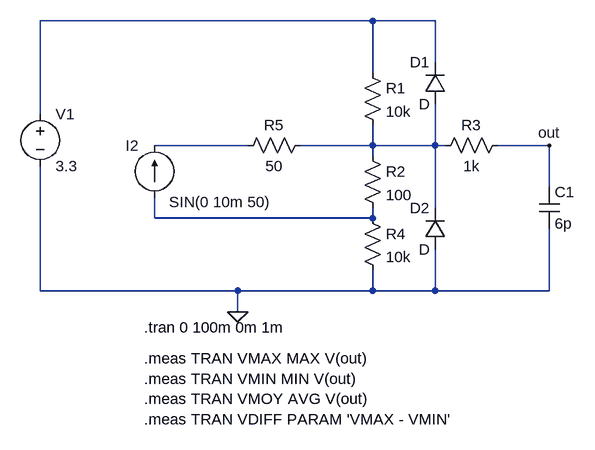
[diagram p0: schematic current_loop.asc]
current_loop.asc, the LTspice schematic file:
Version 4
SHEET 1 880 680
WIRE 256 -368 -256 -368
WIRE 352 -368 256 -368
WIRE 352 -304 352 -368
WIRE 256 -288 256 -368
WIRE -256 -224 -256 -368
WIRE 64 -176 -80 -176
WIRE 256 -176 256 -208
WIRE 256 -176 144 -176
WIRE 352 -176 352 -240
WIRE 352 -176 256 -176
WIRE 368 -176 352 -176
WIRE 528 -176 448 -176
WIRE 256 -160 256 -176
WIRE 528 -112 528 -176
WIRE 352 -80 352 -176
WIRE -80 -64 -80 -96
WIRE 256 -64 256 -80
WIRE 256 -64 -80 -64
WIRE -256 48 -256 -144
WIRE 48 48 -256 48
WIRE 256 48 256 16
WIRE 256 48 48 48
WIRE 352 48 352 -16
WIRE 352 48 256 48
WIRE 528 48 528 -48
WIRE 528 48 352 48
WIRE 48 80 48 48
FLAG 48 80 0
FLAG 528 -176 out
SYMBOL res 240 -304 R0
SYMATTR InstName R1
SYMATTR Value 10k
SYMBOL res 240 -176 R0
SYMATTR InstName R2
SYMATTR Value 100
SYMBOL res 240 -80 R0
SYMATTR InstName R4
SYMATTR Value 10k
SYMBOL voltage -256 -240 R0
WINDOW 123 0 0 Left 0
WINDOW 39 0 0 Left 0
SYMATTR InstName V1
SYMATTR Value 3.3
SYMBOL res 464 -192 R90
WINDOW 0 0 56 VBottom 2
WINDOW 3 32 56 VTop 2
SYMATTR InstName R3
SYMATTR Value 1k
SYMBOL cap 512 -112 R0
SYMATTR InstName C1
SYMATTR Value 6p
SYMBOL diode 368 -240 R180
WINDOW 0 24 64 Left 2
WINDOW 3 24 0 Left 2
SYMATTR InstName D1
SYMBOL diode 368 -16 R180
WINDOW 0 24 64 Left 2
WINDOW 3 24 0 Left 2
SYMATTR InstName D2
SYMBOL res 160 -192 R90
WINDOW 0 0 56 VBottom 2
WINDOW 3 32 56 VTop 2
SYMATTR InstName R5
SYMATTR Value 50
SYMBOL current -80 -96 R180
WINDOW 0 24 80 Left 2
WINDOW 3 -180 -7 Left 2
SYMATTR InstName I2
SYMATTR Value SIN(0 10m 50)
TEXT -96 104 Left 2 !.tran 0 100m 0m 1m
TEXT -96 152 Left 2 !.meas TRAN VMAX MAX V(out)\n.meas TRAN VMIN MIN V(out)\n.meas TRAN VMOY AVG V(out)\n.meas TRAN VDIFF PARAM 'VMAX - VMIN'

The netlist it stands for:
* current_loop.asc
R1 N001 N003 10k
R2 N003 N004 100
R4 N004 0 10k
V1 N001 0 3.3
R3 out N003 1k
C1 out 0 6p
D1 N003 N001 D
D2 0 N003 D
R5 N003 N002 50
I2 N004 N002 SIN(0 10m 50)
.model D D
.lib standard.dio
.tran 0 100m 0m 1m
.meas TRAN VMAX MAX V(out)
.meas TRAN VMIN MIN V(out)
.meas TRAN VMOY AVG V(out)
.meas TRAN VDIFF PARAM 'VMAX - VMIN'
.backanno
.end